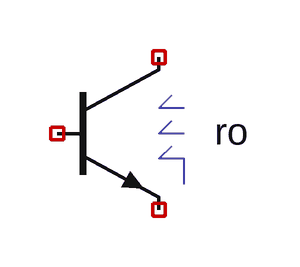
[diagram p0: schematic 5.asc]
5.asc, the LTspice schematic file:
Version 4
SHEET 1 880 680
SYMBOL npn 144 96 R0
WINDOW 0 99 47 Left 2
SYMATTR InstName ro
SYMATTR Value ""
LINE Normal 208 128 224 112 2
LINE Normal 224 128 208 128 2
LINE Normal 208 144 224 128 2
LINE Normal 224 144 208 144 2
LINE Normal 208 160 224 144 2
LINE Normal 224 160 208 160 2
LINE Normal 224 176 224 160 2

The netlist it stands for:
* 5.asc
Q§ro NC_01 NC_02 NC_03 0
.model NPN NPN
.model PNP PNP
.lib standard.bjt
.backanno
.end